# Altium schematic sheet digital_input_protection.SchDoc
size A
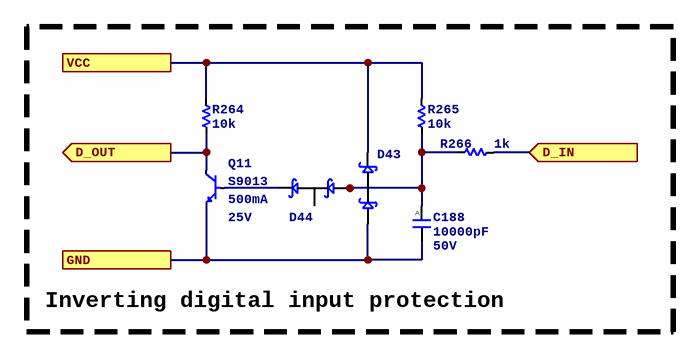
[diagram p0: digital_input_protection.SchDoc]

## Parts
C188  Capacitance: 10000pF  Voltage - Rated: 50V  [C0402_0.50MM]  (hidden comment: CGJ2B3X7R1H103K050BB)
D43  BAT54SLT1G  [3SOT23]  (value not drawn)
D44  BAT54SLT1G  [3SOT23]  (value not drawn)
Q11  S9013  Current: 500mA  Voltage: 25V  [3SOT23]
R264  Resistance: 10k  [R0402_0.40MM]  (hidden comment: ERJ-2RKF1002X)
R265  Resistance: 10k  [R0402_0.40MM]  (hidden comment: ERJ-2RKF1002X)
R266  Resistance: 1k  [R0402_0.40MM]  (hidden comment: ERJ-2RKF1001X)

## Blocks framed on the sheet
Inverting digital input protection: C188 D43 D44 Q11 R264-R266

## Ports
D_IN (in), D_OUT (out), GND, VCC

## Nets
D_IN: R266.1 ; port D_IN
D_OUT: Q11.3(C) R264.1 ; port D_OUT
GND: C188.2 D43.1 Q11.2(E) ; port GND
VCC: D43.2 R264.2 R265.2 ; port VCC
NetC188_1: C188.1 D43.3 D44.1 R265.1 R266.2
NetD44_2: D44.2 Q11.1(B)

Not connected (* = marked no-connect by the designer): D44 3

## Notes on the sheet
- (in symbol CGJ2B3X7R1H103K050BB) A

## Library data of the parts
C188 = CGJ2B3X7R1H103K050BB: CAP CER 10000PF 50V X7R 0402; Manufacturer: TDK Corporation; Unit Price (USD): 0.21; Tolerance: ±10%; ComponentLink1URL: https://product.tdk.com/info/en/catalog/datasheets/mlcc_highreliability_general_en.pdf?ref_disty=digikey; ComponentLink1Description: Series Datasheet; Series: CGJ; Part Status: Active; Temperature Coefficient: X7R; Operating Temperature: -55°C ~ 125°C; Applications: AEC-Q200; Mounting Type: Surface Mount, MLCC; Package / Case: 0402 (1005 Metric); Size / Dimension: 0.039" L x 0.020" W (1.00mm x 0.50mm); Thickness (Max): 0.020" (0.50mm); Supplier 1: Digikey; Supplier Part Number 1: 445-13304-1-ND; Manufacturer Part Number: CGJ2B3X7R1H103K050BB
D43 D44 = SCHOTTKY_30V_DUAL_BAT54SLT1G: DIODE SCHOTTKY DUAL 30V SOT23; Manufacturer: ON Semiconductor; Supplier 1: Digikey; Manufacturer Part Number: BAT54SLT1G; RoHS: RoHS Compliant; ComponentLink1URL: https://www.onsemi.com/pdf/datasheet/bat54slt1-d.pdf; ComponentLink1Description: Datasheet; Supplier Part Number 1: BAT54SLT1GOSCT-ND; Supplier 2: LCSC; Supplier Part Number 2: C19726
Q11 = NPN_25V_S9013: Bipolar (BJT) Transistor NPN 25 V 500 mA 150MHz 300 mW Surface Mount SOT-23; Manufacturer: Shenzhen Slkormicro Semicon Co., Ltd.; Supplier 1: Digikey; Supplier Part Number 1: 5399-S9013CT-ND; Manufacturer Part Number: S9013; ComponentLink1Description: Datasheet; ComponentLink1URL: https://www.onsemi.com/pdf/datasheet/nss1c201mz4-d.pdf; Supplier 2: LCSC; Supplier Part Number 2: C431712
R264 R265 = ERJ-2RKF1002X: RES SMD 10K OHM 1% 1/10W 0402; Manufacturer: Panasonic Electronic Components; Unit Price (USD): 0.1; Power (Watts): 0.1W, 1/10W; Temperature Coefficient: ±100ppm/°C; ComponentLink1Description: Datasheet; ComponentLink1URL: https://industrial.panasonic.com/cdbs/www-data/pdf/RDA0000/AOA0000C304.pdf; Series: ERJ; Tolerance: ±1%; Composition: Thick Film; Features: Automotive AEC-Q200; Operating Temperature: -55°C ~ 155°C; Package / Case: 0402 (1005 Metric); Supplier Device Package: 0402; Size / Dimension: 0.039" L x 0.020" W (1.00mm x 0.50mm); Height - Seated (Max): 0.016" (0.40mm); Supplier 1: Digikey; Supplier Part Number 1: P10.0KLCT-ND; Manufacturer Part Number: ERJ-2RKF1002X
R266 = ERJ-2RKF1001X: RES SMD 1K OHM 1% 1/10W 0402; Manufacturer: Panasonic Electronic Components; Unit Price (USD): 0.1; Power (Watts): 0.1W, 1/10W; Temperature Coefficient: ±100ppm/°C; ComponentLink1Description: Datasheet; ComponentLink1URL: https://industrial.panasonic.com/cdbs/www-data/pdf/RDA0000/AOA0000C304.pdf; Series: ERJ; Tolerance: ±1%; Composition: Thick Film; Features: Automotive AEC-Q200; Operating Temperature: -55°C ~ 155°C; Package / Case: 0402 (1005 Metric); Supplier Device Package: 0402; Size / Dimension: 0.039" L x 0.020" W (1.00mm x 0.50mm); Height - Seated (Max): 0.016" (0.40mm); Supplier 1: Digikey; Supplier Part Number 1: P1.00KLCT-ND; Manufacturer Part Number: ERJ-2RKF1001X